# Altium schematic sheet [4]Footswitches.SchDoc
size A4; SheetNumber: 4; SheetTotal: 5
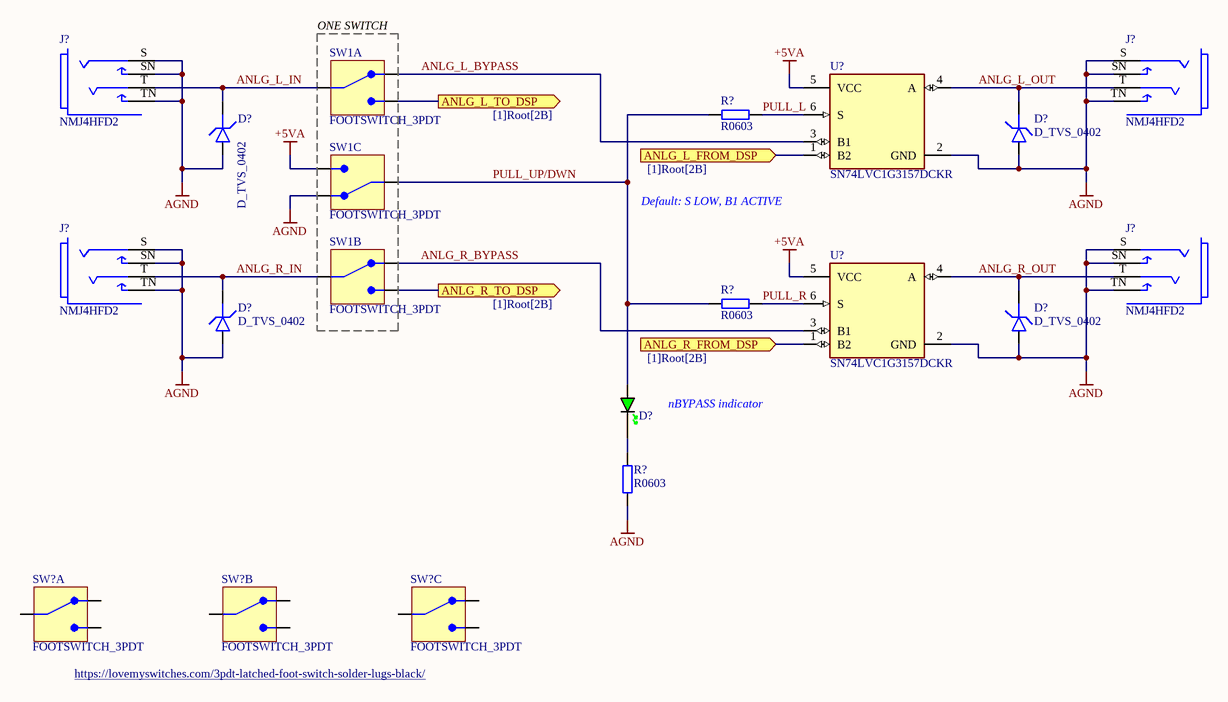
[diagram p0: [4]Footswitches.SchDoc]

## Parts
(Parts that share a designator on the sheet are numbered #1, #2 ... from top to bottom, then left to right.)
D?#1  D_TVS_0402  [D_0402]
D?#2  D_TVS_0402  [D_0402]
D?#3  D_TVS_0402  [D_0402]
D?#4  D_TVS_0402  [D_0402]
D?#5  GREEN  [LED_0603_GREEN]  (value not drawn)
J?#1  NMJ4HFD2  [FP-NMJ4HFD2-MFG]
J?#2  NMJ4HFD2  [FP-NMJ4HFD2-MFG]
J?#3  NMJ4HFD2  [FP-NMJ4HFD2-MFG]
J?#4  NMJ4HFD2  [FP-NMJ4HFD2-MFG]
R?#1  R0603  [RES_0603]
R?#2  R0603  [RES_0603]
R?#3  R0603  [RES_0603]
SW1  FOOTSWITCH_3PDT  [FOOTSWITCH_3PDT]  (parts A,B,C of 3)
SW?#1  FOOTSWITCH_3PDT  [FOOTSWITCH_3PDT]  (part A of 3)
SW?#2  FOOTSWITCH_3PDT  [FOOTSWITCH_3PDT]  (part B of 3)
SW?#3  FOOTSWITCH_3PDT  [FOOTSWITCH_3PDT]  (part C of 3)
U?#1  SN74LVC1G3157DCKR  [FP-DCK0006A-MFG]
U?#2  SN74LVC1G3157DCKR  [FP-DCK0006A-MFG]

## Blocks framed on the sheet
ONE SWITCH: SW1

## Ports
ANLG_L_FROM_DSP (in, see [1]Root[2B]), ANLG_L_TO_DSP (out, see [1]Root[2B]), ANLG_R_FROM_DSP (in, see [1]Root[2B]), ANLG_R_TO_DSP (out, see [1]Root[2B])

## Nets
+5VA: SW1.NO3 U?#1.5(VCC) U?#2.5(VCC)
AGND: D?#1.A D?#2.A D?#3.A D?#4.A J?#1.S J?#1.SN J?#1.TN J?#2.S J?#2.SN J?#2.TN J?#3.S J?#3.SN J?#3.TN J?#4.S J?#4.SN J?#4.TN R?#3.1 SW1.NC3 U?#1.2(GND) U?#2.2(GND)
ANLG_L_BYPASS: SW1.NC1 U?#1.3(B1)
ANLG_L_FROM_DSP: U?#1.1(B2) ; port ANLG_L_FROM_DSP
ANLG_L_IN: D?#1.K J?#1.T SW1.COM1
ANLG_L_OUT: D?#2.K J?#2.T U?#1.4(A)
ANLG_L_TO_DSP: SW1.NO1 ; port ANLG_L_TO_DSP
ANLG_R_BYPASS: SW1.NC2 U?#2.3(B1)
ANLG_R_FROM_DSP: U?#2.1(B2) ; port ANLG_R_FROM_DSP
ANLG_R_IN: D?#3.K J?#3.T SW1.COM2
ANLG_R_OUT: D?#4.K J?#4.T U?#2.4(A)
ANLG_R_TO_DSP: SW1.NO2 ; port ANLG_R_TO_DSP
PULL_L: R?#1.2 U?#1.6(S)
PULL_R: R?#2.2 U?#2.6(S)
PULL_UP/DWN: D?#5.A R?#1.1 R?#2.1 SW1.COM3
NetD?#5_K: D?#5.K R?#3.2

Not connected (* = marked no-connect by the designer): SW?#1 COM1 NC1 NO1; SW?#2 COM2 NC2 NO2; SW?#3 COM3 NC3 NO3

## Notes on the sheet
- Default: S LOW, B1 ACTIVE
- (near D?#5) nBYPASS indicator

## Library data of the parts
D?#1-D?#4 = D_TVS_0402: Diode TVS / ESD 0402
D?#5 = LED_0603_GREEN: LED 0603 GREEN SMD
J?#1-J?#4 = CMP-78736-000001-1: Conn 1/4" Mono Jack F 3 POS Solder RA Thru-Hole 3 Terminal 1 Port; Manufacturer: Neutrik; Number Of Contacts: 2; Current Rating: 0.5A; Voltage Rating: 50V; Conn Orientation: Horizontal; Is Female: yes; Temperature: -25°C to +70°C; ComponentLink2Description: Datasheet; ComponentLink2URL: https://www.neutrik.com/en/product/nmj4hfd2.pdf; Contact Material: Silver; Height: 15.89mm; Package: 0; Mouser Description: Phone Audio Connector, Socket, 2, PCB Mount, Metal Body, Silver Plated Contacts; Manufacturer Part Number: NMJ4HFD2; Automotive: No; RoHS: TRUE; Lead Free: Yes; Device Class L2: Audio / Video Connectors; Device Class L3: unset; Temperature Range Low: -25°C; Category: Conn; Footprint Url: https://www.neutrik.com/media/8576/download/st-nmj4hfd2.pdf?v=1; Temperature Range High: +70°C; Device Class L1: Connectors; Octopart: https://octopart.com/nmj4hfd2-neutrik-758952
R?#1-R?#3 = RES_0603: Resistor SMD 0603; Manufacturer: *; Manufacturer Part Number: *; Distributor Link: *; LCSC: *
SW1 SW?#1-SW?#3 = FOOTSWITCH_3PDT: Generic 3PDT Footswitch; Manufacturer: *; Manufacturer Part Number: *; Link: https://lovemyswitches.com/3pdt-latched-foot-switch-solder-lugs-black/
U?#1 U?#2 = CMP-0859-00516-4: IC SWITCH SPDT SC70-6; Nominal Supply Current: 10uA; Number of Inputs: 1; Supply Type: Single; Operating Supply Current: 1uA; Polarity: Non-Inverting; Low Level Output Current: 128mA; Bandwidth: 300MHz; Max Supply Voltage: 5.5V; Turn-Off Delay Time: 3.8ns; Turn-On Delay Time: 5.7ns; Number of Outputs: 2; Min Supply Voltage: 1.65V; Propagation Delay: 300ps; On-State Resistance: 15R; Mount: Surface Mount; Throw Configuration: SPDT; Min Operating Temperature: -40°C; Radiation Hardening: No; Number of Pins: 6; Case/Package: SC; Length: 2mm; Lead Free: Lead Free; REACH SVHC: No SVHC; Termination: SMD/SMT; High Level Output Current: 128mA; Height: 0.9mm; Weight: 8.8E-05oz; Package Quantity: 3000; Number of Channels: 1; Packaging: Tape and Reel; Number of Bits: 1; Width: 1.25mm; Max Operating Temperature: 125°C; Max Supply Current: 10uA; Contact Plating: Gold; RoHS Compliant: Yes